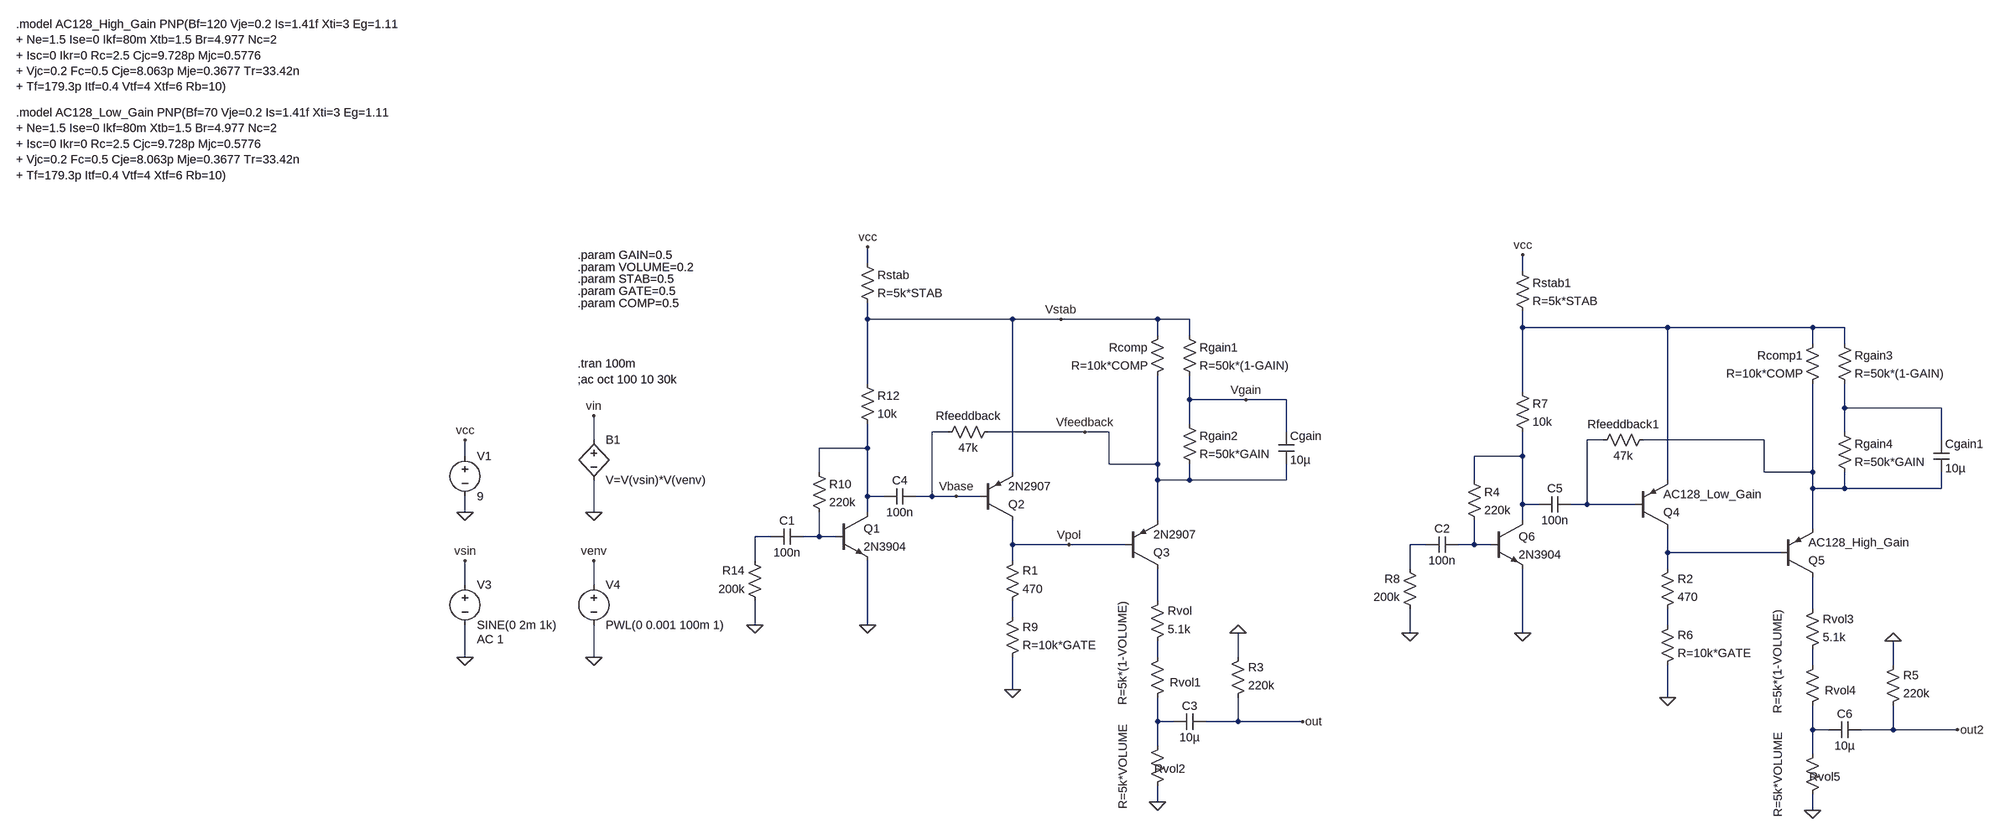
[diagram p0: schematic fuzz_factory_base_02.asc]
fuzz_factory_base_02.asc, the LTspice schematic file:
Version 4
SHEET 1 2404 1668
WIRE 32 -272 32 -304
WIRE 1472 -256 1472 -288
WIRE 32 -160 32 -192
WIRE 320 -160 32 -160
WIRE 416 -160 320 -160
WIRE 608 -160 416 -160
WIRE 672 -160 608 -160
WIRE 1472 -144 1472 -176
WIRE 1760 -144 1472 -144
WIRE 2048 -144 1760 -144
WIRE 2112 -144 2048 -144
WIRE 608 -128 608 -160
WIRE 672 -128 672 -160
WIRE 2048 -112 2048 -144
WIRE 2112 -112 2112 -144
WIRE 32 -32 32 -160
WIRE 1472 -16 1472 -144
WIRE 672 0 672 -48
WIRE 784 0 672 0
WIRE 864 0 784 0
WIRE 2112 16 2112 -32
WIRE 2304 16 2112 16
WIRE 672 48 672 0
WIRE 192 64 160 64
WIRE 464 64 272 64
WIRE 512 64 464 64
WIRE 864 64 864 0
WIRE 2112 64 2112 16
WIRE -512 80 -512 32
WIRE 1632 80 1600 80
WIRE 1952 80 1712 80
WIRE 2304 80 2304 16
WIRE 32 96 32 48
WIRE 32 96 -64 96
WIRE -768 112 -768 80
WIRE 1472 112 1472 64
WIRE 1472 112 1376 112
WIRE 512 128 512 64
WIRE 608 128 608 -48
WIRE 608 128 512 128
WIRE -64 144 -64 96
WIRE 320 144 320 -160
WIRE 1952 144 1952 80
WIRE 2048 144 2048 -32
WIRE 2048 144 1952 144
WIRE 608 160 608 128
WIRE 672 160 672 128
WIRE 672 160 608 160
WIRE 864 160 864 128
WIRE 864 160 672 160
WIRE 1376 160 1376 112
WIRE 1760 160 1760 -144
WIRE 2048 176 2048 144
WIRE 2112 176 2112 144
WIRE 2112 176 2048 176
WIRE 2304 176 2304 144
WIRE 2304 176 2112 176
WIRE 32 192 32 96
WIRE 64 192 32 192
WIRE 160 192 160 64
WIRE 160 192 128 192
WIRE 208 192 160 192
WIRE 256 192 208 192
WIRE 1472 208 1472 112
WIRE 1504 208 1472 208
WIRE 1600 208 1600 80
WIRE 1600 208 1568 208
WIRE 1696 208 1600 208
WIRE -768 224 -768 192
WIRE -512 224 -512 160
WIRE 32 224 32 192
WIRE 608 240 608 160
WIRE 1472 240 1472 208
WIRE 2048 256 2048 176
WIRE -160 272 -192 272
WIRE -64 272 -64 224
WIRE -64 272 -96 272
WIRE -32 272 -64 272
WIRE 320 288 320 240
WIRE 432 288 320 288
WIRE 544 288 432 288
WIRE 1280 288 1248 288
WIRE 1376 288 1376 240
WIRE 1376 288 1344 288
WIRE 1408 288 1376 288
WIRE 1760 304 1760 256
WIRE 1984 304 1760 304
WIRE -192 320 -192 272
WIRE 320 320 320 288
WIRE 1248 336 1248 288
WIRE 1760 336 1760 304
WIRE -768 368 -768 320
WIRE -512 368 -512 320
WIRE 608 400 608 336
WIRE 2048 416 2048 352
WIRE 320 432 320 400
WIRE -192 448 -192 400
WIRE 32 448 32 320
WIRE 1760 448 1760 416
WIRE 1248 464 1248 416
WIRE 1472 464 1472 336
WIRE -768 512 -768 448
WIRE -512 512 -512 448
WIRE 608 512 608 480
WIRE 768 512 768 464
WIRE 2048 528 2048 496
WIRE 2208 528 2208 480
WIRE 320 576 320 512
WIRE 1760 592 1760 528
WIRE 608 640 608 592
WIRE 640 640 608 640
WIRE 768 640 768 592
WIRE 768 640 704 640
WIRE 896 640 768 640
WIRE 2048 656 2048 608
WIRE 2080 656 2048 656
WIRE 2208 656 2208 608
WIRE 2208 656 2144 656
WIRE 2336 656 2208 656
WIRE 608 688 608 640
WIRE 2048 704 2048 656
WIRE 608 800 608 768
WIRE 2048 816 2048 784
FLAG -768 80 vcc
FLAG -768 224 0
FLAG 896 640 out
FLAG -512 224 0
FLAG -768 512 0
FLAG -512 512 0
FLAG -768 320 vsin
FLAG -512 320 venv
FLAG 768 464 0
FLAG -192 448 0
FLAG 32 448 0
FLAG 32 -304 vcc
FLAG 320 576 0
FLAG 608 800 0
FLAG -512 32 vin
FLAG 416 -160 Vstab
FLAG 464 64 Vfeedback
FLAG 432 288 Vpol
FLAG 784 0 Vgain
FLAG 208 192 Vbase
FLAG 2336 656 out2
FLAG 2208 480 0
FLAG 1248 464 0
FLAG 1472 464 0
FLAG 1472 -288 vcc
FLAG 1760 592 0
FLAG 2048 816 0
SYMBOL voltage -768 96 R0
WINDOW 123 0 0 Left 2
WINDOW 39 0 0 Left 2
SYMATTR InstName V1
SYMATTR Value 9
SYMBOL voltage -768 352 R0
WINDOW 123 24 124 Left 2
WINDOW 39 0 0 Left 2
SYMATTR Value2 AC 1
SYMATTR InstName V3
SYMATTR Value SINE(0 2m 1k)
SYMBOL voltage -512 352 R0
WINDOW 123 0 0 Left 2
WINDOW 39 0 0 Left 2
SYMATTR InstName V4
SYMATTR Value PWL(0 0.001 100m 1)
SYMBOL bv -512 64 R0
SYMATTR InstName B1
SYMATTR Value V=V(vsin)*V(venv)
SYMBOL pnp 256 240 M180
SYMATTR InstName Q2
SYMATTR Value 2N2907
SYMBOL pnp 544 336 M180
SYMATTR InstName Q3
SYMATTR Value 2N2907
SYMBOL cap -96 256 R90
WINDOW 0 0 32 VBottom 2
WINDOW 3 32 32 VTop 2
SYMATTR InstName C1
SYMATTR Value 100n
SYMBOL res 304 416 M180
WINDOW 0 36 76 Left 2
WINDOW 3 36 40 Left 2
SYMATTR InstName R1
SYMATTR Value 470
SYMBOL res 592 496 M180
WINDOW 0 36 76 Left 2
WINDOW 3 36 40 Left 2
SYMATTR InstName Rvol
SYMATTR Value 5.1k
SYMBOL res 288 48 R90
WINDOW 0 0 56 VBottom 2
WINDOW 3 32 56 VTop 2
SYMATTR InstName Rfeeddback
SYMATTR Value 47k
SYMBOL res 656 -144 R0
SYMATTR InstName Rgain1
SYMATTR Value R=50k*(1-GAIN)
SYMBOL res 656 32 R0
SYMATTR InstName Rgain2
SYMATTR Value R=50k*GAIN
SYMBOL cap 848 64 R0
SYMATTR InstName Cgain
SYMATTR Value 10µ
SYMBOL res 624 496 M0
WINDOW 0 -70 66 Left 2
WINDOW 3 85 112 VLeft 2
SYMATTR InstName Rvol1
SYMATTR Value R=5k*(1-VOLUME)
SYMBOL res 624 672 M0
WINDOW 0 -39 62 Left 2
WINDOW 3 84 142 VLeft 2
SYMATTR InstName Rvol2
SYMATTR Value R=5k*VOLUME
SYMBOL npn -32 224 R0
SYMATTR InstName Q1
SYMATTR Value 2N3904
SYMBOL res -80 128 R0
SYMATTR InstName R10
SYMATTR Value 220k
SYMBOL cap 128 176 R90
WINDOW 0 0 32 VBottom 2
WINDOW 3 32 32 VTop 2
SYMATTR InstName C4
SYMATTR Value 100n
SYMBOL cap 704 656 M270
WINDOW 0 32 32 VTop 2
WINDOW 3 0 32 VBottom 2
SYMATTR InstName C3
SYMATTR Value 10µ
SYMBOL res 752 608 M180
WINDOW 0 36 76 Left 2
WINDOW 3 36 40 Left 2
SYMATTR InstName R3
SYMATTR Value 220k
SYMBOL res 304 528 M180
WINDOW 0 36 76 Left 2
WINDOW 3 36 40 Left 2
SYMATTR InstName R9
SYMATTR Value R=10k*GATE
SYMBOL res 16 -48 R0
SYMATTR InstName R12
SYMATTR Value 10k
SYMBOL res 624 -144 M0
SYMATTR InstName Rcomp
SYMATTR Value R=10k*COMP
SYMBOL res -176 416 R180
WINDOW 0 36 76 Left 2
WINDOW 3 36 40 Left 2
SYMATTR InstName R14
SYMATTR Value 200k
SYMBOL res 16 -288 R0
SYMATTR InstName Rstab
SYMATTR Value R=5k*STAB
SYMBOL pnp 1696 256 M180
SYMATTR InstName Q4
SYMATTR Value AC128_Low_Gain
SYMBOL pnp 1984 352 M180
SYMATTR InstName Q5
SYMATTR Value AC128_High_Gain
SYMBOL cap 1344 272 R90
WINDOW 0 0 32 VBottom 2
WINDOW 3 32 32 VTop 2
SYMATTR InstName C2
SYMATTR Value 100n
SYMBOL res 1744 432 M180
WINDOW 0 36 76 Left 2
WINDOW 3 36 40 Left 2
SYMATTR InstName R2
SYMATTR Value 470
SYMBOL res 2032 512 M180
WINDOW 0 36 76 Left 2
WINDOW 3 36 40 Left 2
SYMATTR InstName Rvol3
SYMATTR Value 5.1k
SYMBOL res 1728 64 R90
WINDOW 0 0 56 VBottom 2
WINDOW 3 32 56 VTop 2
SYMATTR InstName Rfeeddback1
SYMATTR Value 47k
SYMBOL res 2096 -128 R0
SYMATTR InstName Rgain3
SYMATTR Value R=50k*(1-GAIN)
SYMBOL res 2096 48 R0
SYMATTR InstName Rgain4
SYMATTR Value R=50k*GAIN
SYMBOL cap 2288 80 R0
SYMATTR InstName Cgain1
SYMATTR Value 10µ
SYMBOL res 2064 512 M0
WINDOW 0 -70 66 Left 2
WINDOW 3 85 112 VLeft 2
SYMATTR InstName Rvol4
SYMATTR Value R=5k*(1-VOLUME)
SYMBOL res 2064 688 M0
WINDOW 0 -39 62 Left 2
WINDOW 3 84 142 VLeft 2
SYMATTR InstName Rvol5
SYMATTR Value R=5k*VOLUME
SYMBOL npn 1408 240 R0
SYMATTR InstName Q6
SYMATTR Value 2N3904
SYMBOL res 1360 144 R0
SYMATTR InstName R4
SYMATTR Value 220k
SYMBOL cap 1568 192 R90
WINDOW 0 0 32 VBottom 2
WINDOW 3 32 32 VTop 2
SYMATTR InstName C5
SYMATTR Value 100n
SYMBOL cap 2144 672 M270
WINDOW 0 32 32 VTop 2
WINDOW 3 0 32 VBottom 2
SYMATTR InstName C6
SYMATTR Value 10µ
SYMBOL res 2192 624 M180
WINDOW 0 36 76 Left 2
WINDOW 3 36 40 Left 2
SYMATTR InstName R5
SYMATTR Value 220k
SYMBOL res 1744 544 M180
WINDOW 0 36 76 Left 2
WINDOW 3 36 40 Left 2
SYMATTR InstName R6
SYMATTR Value R=10k*GATE
SYMBOL res 1456 -32 R0
SYMATTR InstName R7
SYMATTR Value 10k
SYMBOL res 2064 -128 M0
SYMATTR InstName Rcomp1
SYMATTR Value R=10k*COMP
SYMBOL res 1264 432 R180
WINDOW 0 36 76 Left 2
WINDOW 3 36 40 Left 2
SYMATTR InstName R8
SYMATTR Value 200k
SYMBOL res 1456 -272 R0
SYMATTR InstName Rstab1
SYMATTR Value R=5k*STAB
TEXT -544 -288 Left 2 !.param GAIN=0.5
TEXT -544 -264 Left 2 !.param VOLUME=0.2
TEXT -544 -240 Left 2 !.param STAB=0.5
TEXT -544 -72 Left 2 !.tran 100m
TEXT -544 -40 Left 2 !;ac oct 100 10 30k
TEXT -1800 -608 Left 2 !.model AC128_Low_Gain PNP(Bf=70 Vje=0.2 Is=1.41f Xti=3 Eg=1.11\n+ Ne=1.5 Ise=0 Ikf=80m Xtb=1.5 Br=4.977 Nc=2\n+ Isc=0 Ikr=0 Rc=2.5 Cjc=9.728p Mjc=0.5776\n+ Vjc=0.2 Fc=0.5 Cje=8.063p Mje=0.3677 Tr=33.42n\n+ Tf=179.3p Itf=0.4 Vtf=4 Xtf=6 Rb=10)
TEXT -1800 -784 Left 2 !.model AC128_High_Gain PNP(Bf=120 Vje=0.2 Is=1.41f Xti=3 Eg=1.11\n+ Ne=1.5 Ise=0 Ikf=80m Xtb=1.5 Br=4.977 Nc=2\n+ Isc=0 Ikr=0 Rc=2.5 Cjc=9.728p Mjc=0.5776\n+ Vjc=0.2 Fc=0.5 Cje=8.063p Mje=0.3677 Tr=33.42n\n+ Tf=179.3p Itf=0.4 Vtf=4 Xtf=6 Rb=10)
TEXT -544 -216 Left 2 !.param GATE=0.5
TEXT -544 -192 Left 2 !.param COMP=0.5

The netlist it stands for:
* fuzz_factory_base_02.asc
V1 vcc 0 9
V3 vsin 0 SINE(0 2m 1k) AC 1
V4 venv 0 PWL(0 0.001 100m 1)
B1 vin 0 V=V(vsin)*V(venv)
Q2 Vpol Vbase Vstab 0 2N2907
Q3 N012 Vpol Vfeedback 0 2N2907
C1 N008 N007 100n
R1 N014 Vpol 470
Rvol N016 N012 5.1k
Rfeeddback Vfeedback Vbase 47k
Rgain1 Vstab Vgain R=50k*(1-GAIN)
Rgain2 Vgain Vfeedback R=50k*GAIN
Cgain Vgain Vfeedback 10µ
Rvol1 N016 N018 R=5k*(1-VOLUME)
Rvol2 N018 0 R=5k*VOLUME
Q1 N005 N008 0 0 2N3904
R10 N005 N008 220k
C4 Vbase N005 100n
C3 out N018 10µ
R3 out 0 220k
R9 0 N014 R=10k*GATE
R12 Vstab N005 10k
Rcomp Vstab Vfeedback R=10k*COMP
R14 0 N007 200k
Rstab vcc Vstab R=5k*STAB
Q4 N011 N003 N001 0 AC128_Low_Gain
Q5 N013 N011 N004 0 AC128_High_Gain
C2 N010 N009 100n
R2 N015 N011 470
Rvol3 N017 N013 5.1k
Rfeeddback1 N004 N003 47k
Rgain3 N001 N002 R=50k*(1-GAIN)
Rgain4 N002 N004 R=50k*GAIN
Cgain1 N002 N004 10µ
Rvol4 N017 N019 R=5k*(1-VOLUME)
Rvol5 N019 0 R=5k*VOLUME
Q6 N006 N010 0 0 2N3904
R4 N006 N010 220k
C5 N003 N006 100n
C6 out2 N019 10µ
R5 out2 0 220k
R6 0 N015 R=10k*GATE
R7 N001 N006 10k
Rcomp1 N001 N004 R=10k*COMP
R8 0 N009 200k
Rstab1 vcc N001 R=5k*STAB
.model NPN NPN
.model PNP PNP
.lib standard.bjt
.param GAIN=0.5
.param VOLUME=0.2
.param STAB=0.5
.tran 100m
;ac oct 100 10 30k
.model AC128_Low_Gain PNP(Bf=70 Vje=0.2 Is=1.41f Xti=3 Eg=1.11
+ Ne=1.5 Ise=0 Ikf=80m Xtb=1.5 Br=4.977 Nc=2
+ Isc=0 Ikr=0 Rc=2.5 Cjc=9.728p Mjc=0.5776
+ Vjc=0.2 Fc=0.5 Cje=8.063p Mje=0.3677 Tr=33.42n
+ Tf=179.3p Itf=0.4 Vtf=4 Xtf=6 Rb=10)
.model AC128_High_Gain PNP(Bf=120 Vje=0.2 Is=1.41f Xti=3 Eg=1.11
+ Ne=1.5 Ise=0 Ikf=80m Xtb=1.5 Br=4.977 Nc=2
+ Isc=0 Ikr=0 Rc=2.5 Cjc=9.728p Mjc=0.5776
+ Vjc=0.2 Fc=0.5 Cje=8.063p Mje=0.3677 Tr=33.42n
+ Tf=179.3p Itf=0.4 Vtf=4 Xtf=6 Rb=10)
.param GATE=0.5
.param COMP=0.5
.backanno
.end